# Altium schematic sheet MCU.SchDoc
size Letter; SheetNumber: 8; SheetTotal: 8
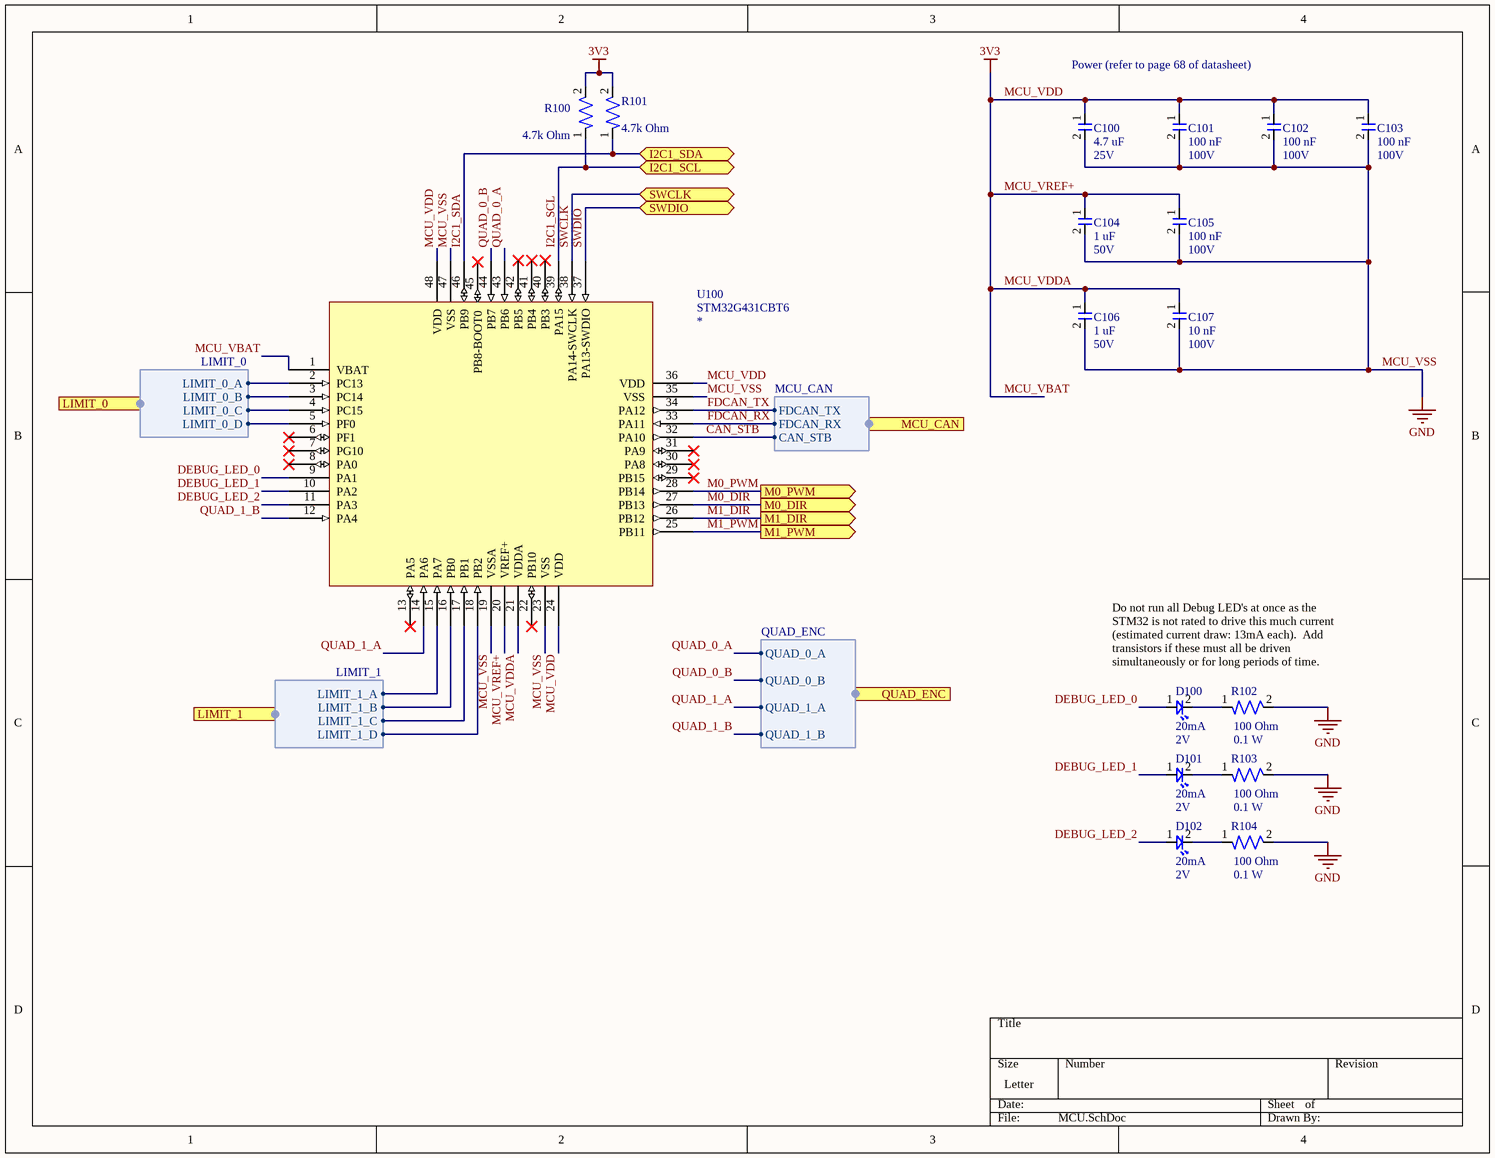
[diagram p0: MCU.SchDoc]

## Parts
C100  Capacitance: 4.7 uF  Voltage Rating: 25V  [CAP-0603]  (hidden comment: TMK107BBJ475KA-T)
C101  Capacitance: 100 nF  Voltage Rating: 100V  [CAP-0603]  (hidden comment: CC0603KRX7R0BB104)
C102  Capacitance: 100 nF  Voltage Rating: 100V  [CAP-0603]  (hidden comment: CC0603KRX7R0BB104)
C103  Capacitance: 100 nF  Voltage Rating: 100V  [CAP-0603]  (hidden comment: CC0603KRX7R0BB104)
C104  Capacitance: 1 uF  Voltage: 50V  [CAP-0603]  (hidden comment: UMK107AB7105KA-T)
C105  Capacitance: 100 nF  Voltage Rating: 100V  [CAP-0603]  (hidden comment: CC0603KRX7R0BB104)
C106  Capacitance: 1 uF  Voltage: 50V  [CAP-0603]  (hidden comment: UMK107AB7105KA-T)
C107  Capacitance: 10 nF  Voltage Rating: 100V  [CAP-0402]  (hidden comment: CC0402KRX7R0BB103)
D100  Current Rating: 20mA  Vf: 2V  [LED-0603]  (hidden comment: 150060AS75000)
D101  Current Rating: 20mA  Vf: 2V  [LED-0603]  (hidden comment: 150060AS75000)
D102  Current Rating: 20mA  Vf: 2V  [LED-0603]  (hidden comment: 150060AS75000)
R100  Resistance: 4.7k Ohm  [RES-0603]  (hidden comment: AF0603FR-074K7L)
R101  Resistance: 4.7k Ohm  [RES-0603]  (hidden comment: AF0603FR-074K7L)
R102  Resistance: 100 Ohm  Power: 0.1 W  [RES-0603]  (hidden comment: AC0603FR-10100RL)
R103  Resistance: 100 Ohm  Power: 0.1 W  [RES-0603]  (hidden comment: AC0603FR-10100RL)
R104  Resistance: 100 Ohm  Power: 0.1 W  [RES-0603]  (hidden comment: AC0603FR-10100RL)
U100  STM32G431CBT6  [Quad48]

## Ports
I2C1_SCL (bidir), I2C1_SDA (bidir), LIMIT_0 (harness LIMIT_0), LIMIT_1 (harness LIMIT_1), M0_DIR (out), M0_PWM (out), M1_DIR (out), M1_PWM (out), MCU_CAN (harness MCU_CAN), QUAD_ENC (harness QUAD_ENC), SWCLK (bidir), SWDIO (bidir)

## Harnesses
LIMIT_0: LIMIT_0_A, LIMIT_0_B, LIMIT_0_C, LIMIT_0_D
LIMIT_1: LIMIT_1_A, LIMIT_1_B, LIMIT_1_C, LIMIT_1_D
MCU_CAN: FDCAN_TX, FDCAN_RX, CAN_STB
QUAD_ENC: QUAD_0_A, QUAD_1_A, QUAD_1_B, QUAD_0_B

## Nets
MCU_VBAT: C100.1 C101.1 C102.1 C103.1 C104.1 C105.1 C106.1 C107.1 R100.2 R101.2 U100.1(VBAT) U100.20(VREF+) U100.21(VDDA) U100.24(VDD) U100.36(VDD) U100.48(VDD)  [also labelled 3V3, MCU_VDD, MCU_VDDA, MCU_VREF+]
MCU_VSS: C100.2 C101.2 C102.2 C103.2 C104.2 C105.2 C106.2 C107.2 R102.2 R103.2 R104.2 U100.19(VSSA) U100.23(VSS) U100.35(VSS) U100.47(VSS)  [also labelled GND]
CAN_STB: U100.32(PA10) ; port MCU_CAN.CAN_STB
DEBUG_LED_0: D100.1 U100.9(PA1)
DEBUG_LED_1: D101.1 U100.10(PA2)
DEBUG_LED_2: D102.1 U100.11(PA3)
FDCAN_RX: U100.33(PA11) ; port MCU_CAN.FDCAN_RX
FDCAN_TX: U100.34(PA12) ; port MCU_CAN.FDCAN_TX
I2C1_SCL: R100.1 U100.39(PA15) ; port I2C1_SCL
I2C1_SDA: R101.1 U100.46(PB9) ; port I2C1_SDA
M0_DIR: U100.27(PB13) ; port M0_DIR
M0_PWM: U100.28(PB14) ; port M0_PWM
M1_DIR: U100.26(PB12) ; port M1_DIR
M1_PWM: U100.25(PB11) ; port M1_PWM
QUAD_0_A: U100.43(PB6) ; port QUAD_ENC.QUAD_0_A
QUAD_0_B: U100.44(PB7) ; port QUAD_ENC.QUAD_0_B
QUAD_1_A: U100.14(PA6) ; port QUAD_ENC.QUAD_1_A
QUAD_1_B: U100.12(PA4) ; port QUAD_ENC.QUAD_1_B
SWCLK: U100.38(PA14-SWCLK) ; port SWCLK
SWDIO: U100.37(PA13-SWDIO) ; port SWDIO
NetD100_2: D100.2 R102.1
NetD101_2: D101.2 R103.1
NetD102_2: D102.2 R104.1
NetU100_2: U100.2(PC13) ; port LIMIT_0.LIMIT_0_A
NetU100_3: U100.3(PC14) ; port LIMIT_0.LIMIT_0_B
NetU100_4: U100.4(PC15) ; port LIMIT_0.LIMIT_0_C
NetU100_5: U100.5(PF0) ; port LIMIT_0.LIMIT_0_D
NetU100_15: U100.15(PA7) ; port LIMIT_1.LIMIT_1_A
NetU100_16: U100.16(PB0) ; port LIMIT_1.LIMIT_1_B
NetU100_17: U100.17(PB1) ; port LIMIT_1.LIMIT_1_C
NetU100_18: U100.18(PB2) ; port LIMIT_1.LIMIT_1_D

Not connected (* = marked no-connect by the designer): U100 6(PF1)* 7(PG10)* 8(PA0)* 13(PA5)* 22(PB10)* 29(PB15)* 30(PA8)* 31(PA9)* 40(PB3)* 41(PB4)* 42(PB5)* 45(PB8-BOOT0)*

## Notes on the sheet
- Power (refer to page 68 of datasheet)
- Do not run all Debug LED's at once as the STM32 is not rated to drive this much current (estimated current draw: 13mA each).  Add transistors if these must all be driven simultaneously or for long periods of time.

## Library data of the parts
C100 = CAP-4.7U-0001: 4.7 µF ±10% 25V Ceramic Capacitor X5R 0603 (1608 Metric); Manufacturer: Taiyo Yuden; Assembled?: no; Manufacturer Part Number: TMK107BBJ475KA-T; Temperature Coefficient: X5R; Package Size: 0603; Tolerance: 10%
C101-C103 C105 = CAP-100N-0001: CAP CER 0.1UF 100V X7R 0603; Manufacturer: YAGEO; Assembled?: no; Tolerance: 10%; Manufacturer Part Number: CC0603KRX7R0BB104; Temperature Coefficient: X7R; Package Size: 0603
C104 C106 = CAP-1U-0002: 1 µF ±10% 50V Ceramic Capacitor X7R 0603 (1608 Metric); Package Size: 0603; Tolerance: 10%
C107 = CAP-10N-0001: 10000 pF ±10% 100V Ceramic Capacitor X7R 0402 (1005 Metric); Manufacturer: YAGEO; Assembled?: no; Manufacturer Part Number: CC0402KRX7R0BB103; Temperature Coefficient: X7R; Package Size: 0402; Tolerance: 10%
D100-D102 = LED_Amber_0001: CAP CER 0.1UF 100V X7R 0603; Manufacturer: Wurth Electronik; Assembled?: no; Color: Amber; Manufacturer Part Number: 150060AS75000; Package Size: 0603
R100 R101 = RES-4.7K-0002: RES SMD 4.7K OHM 1% 1/10W 0603; Manufacturer: YAGEO; Assembled?: no; Power: 0.1 W; Manufacturer Part Number: AF0603FR-074K7L; Package Size: 0603; Tolerance: 1%
R102-R104 = RES-100-0002: 100 Ohms ±1% 0.1W, 1/10W Chip Resistor 0603 (1608 Metric) Automotive AEC-Q200 Thick Film; Manufacturer: YAGEO; Assembled?: no; Manufacturer Part Number: AC0603FR-10100RL; Package Size: 0603; Tolerance: 1%
U100 = IC-STM32G431CBT6: ARM® Cortex®-M4F STM32G4 Microcontroller IC 32-Bit Single-Core 170MHz 128KB (128K x 8) FLASH 48-LQFP (7x7); Parameter 1: *